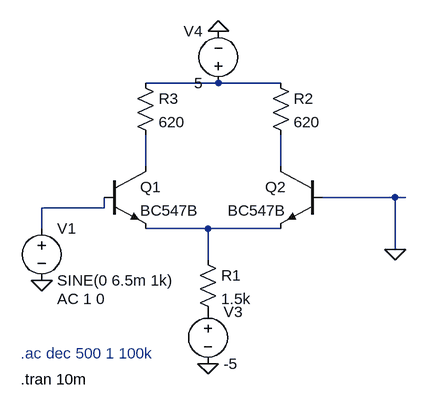
[diagram p0: schematic pre_last.asc]
pre_last.asc, the LTspice schematic file:
Version 4
SHEET 1 5540 740
WIRE 176 -16 64 -16
WIRE 272 -16 176 -16
WIRE 272 112 272 64
WIRE 64 112 64 64
WIRE 448 160 336 160
WIRE 464 160 448 160
WIRE 0 176 0 160
WIRE 0 176 -96 176
WIRE -96 208 -96 176
WIRE 160 208 64 208
WIRE 272 208 160 208
WIRE 448 240 448 160
WIRE 160 256 160 208
FLAG -96 288 0
FLAG 176 -96 0
FLAG 160 416 0
FLAG 448 240 0
SYMBOL npn 0 112 R0
SYMATTR InstName Q1
SYMATTR Value BC547B
SYMBOL npn 336 112 M0
SYMATTR InstName Q2
SYMATTR Value BC547B
SYMBOL res 144 240 R0
SYMATTR InstName R1
SYMATTR Value 1.5k
SYMBOL res 256 -32 R0
SYMATTR InstName R2
SYMATTR Value 620
SYMBOL res 48 -32 R0
SYMATTR InstName R3
SYMATTR Value 620
SYMBOL voltage -96 192 R0
WINDOW 123 24 124 Left 2
WINDOW 39 0 0 Left 0
SYMATTR Value2 AC 1 0
SYMATTR InstName V1
SYMATTR Value SINE(0 6.5m 1k)
SYMBOL voltage 160 320 R0
WINDOW 123 0 0 Left 0
WINDOW 39 0 0 Left 0
SYMATTR InstName V3
SYMATTR Value -5
SYMBOL voltage 176 0 R180
WINDOW 0 24 96 Left 2
WINDOW 3 24 16 Left 2
WINDOW 123 0 0 Left 0
WINDOW 39 0 0 Left 0
SYMATTR InstName V4
SYMATTR Value 5
TEXT -128 440 Left 2 !.tran 10m
TEXT -128 400 Left 2 ;.ac dec 500 1 100k

The netlist it stands for:
* pre_last.asc
Q1 N003 N004 N005 0 BC547B
Q2 N002 0 N005 0 BC547B
R1 N005 P001 1.5k
R2 N001 N002 620
R3 N001 N003 620
V1 N004 0 SINE(0 6.5m 1k) AC 1 0
V3 P001 0 -5
V4 N001 0 5
.model NPN NPN
.model PNP PNP
.lib standard.bjt
.tran 10m
* .ac dec 500 1 100k
.backanno
.end